# Altium schematic sheet 7V4输出2.SchDoc
size A4
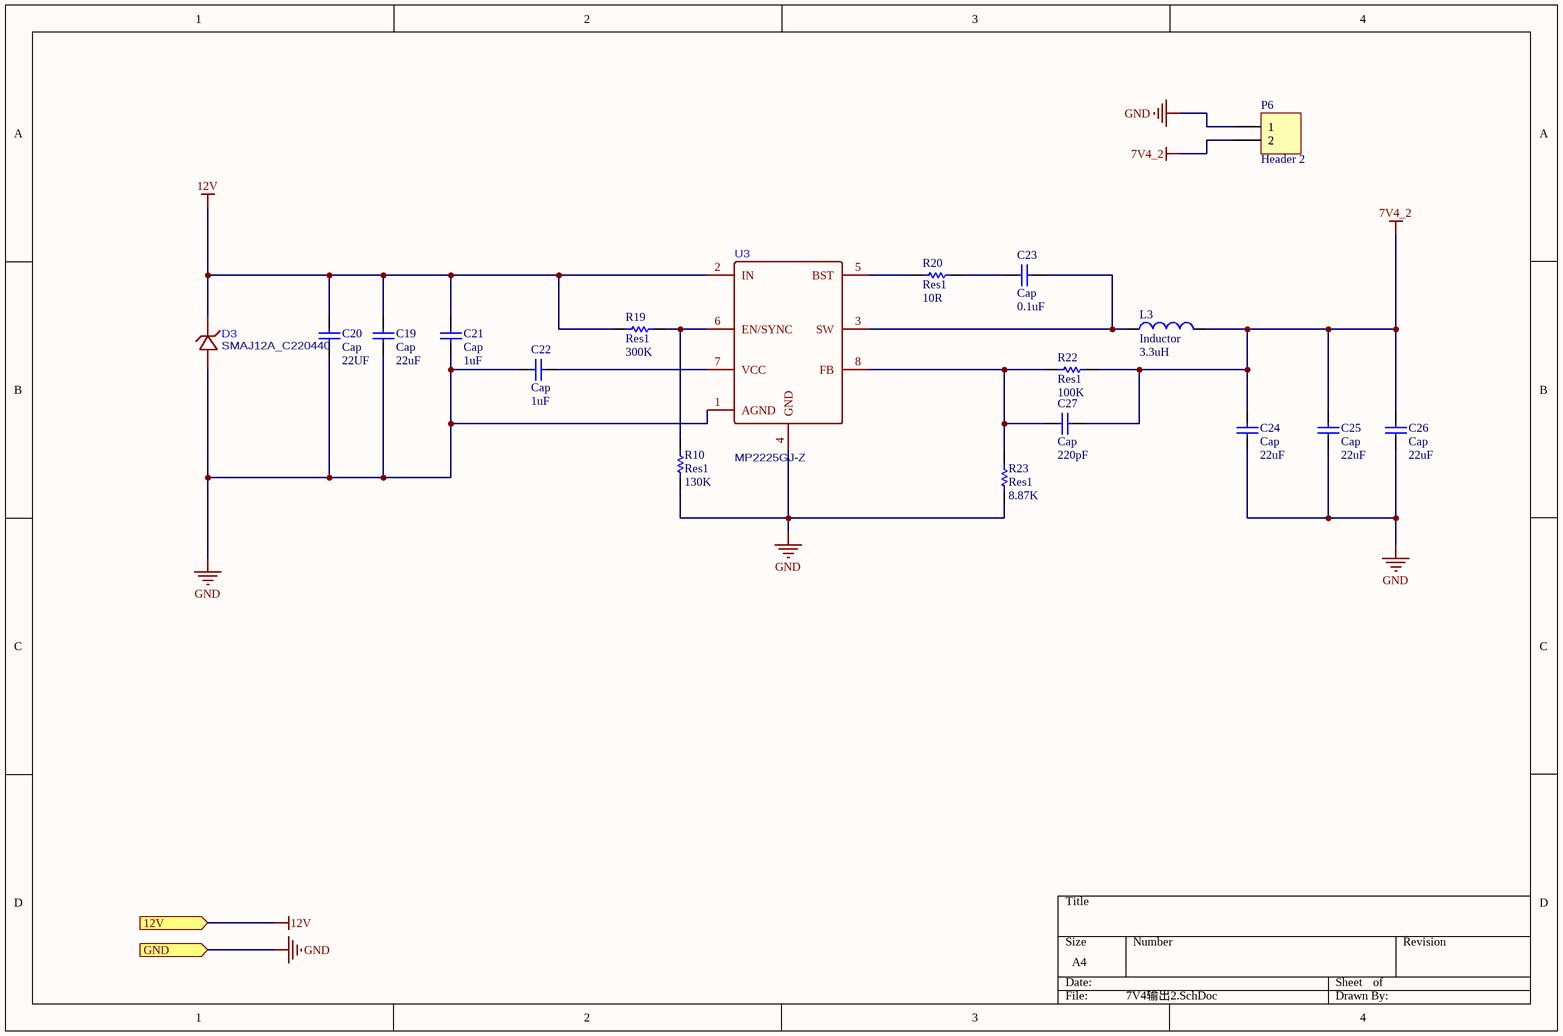
[diagram p0: 7V4输出2.SchDoc]

## Parts
C19  Cap  value 22uF  [C1206]
C20  Cap  value 22UF  [C1206]
C21  Cap  value 1uF  [R0603]
C22  Cap  value 1uF  [R0603]
C23  Cap  value 0.1uF  [R0603]
C24  Cap  value 22uF  [C0805]
C25  Cap  value 22uF  [C0805]
C26  Cap  value 22uF  [C0805]
C27  Cap  value 220pF  [R0603]
D3  SMAJ12A_C220440  [SMA_L4.4-W2.8-LS5.4-RD]
L3  Inductor  value 3.3uH  [IND-SMD_L7.8-W7.0_MAPM0630F]
P6  Header 2  [XH2.54-2A]
R10  Res1  value 130K  [R0603]
R19  Res1  value 300K  [R0603]
R20  Res1  value 10R  [R0603]
R22  Res1  value 100K  [R0603]
R23  Res1  value 8.87K  [R0603]
U3  MP2225GJ-Z  [TSOT-23-8_L2.9-W1.6-P0.65-LS2.8-BR]

## Ports
12V (in), GND (in)

## Nets
7V4_2: C24.2 C25.2 C26.2 C27.2 L3.2 P6.2 R22.2
12V: C19.2 C20.2 C21.2 D3.1 R19.1 U3.2(IN) ; port 12V
GND: C19.1 C20.1 C21.1 C22.1 C24.1 C25.1 C26.1 D3.2 P6.1 R10.1 R23.1 U3.1(AGND) U3.4(GND) ; port GND
NetC22_2: C22.2 U3.7(VCC)
NetC23_1: C23.1 R20.2
NetC23_2: C23.2 L3.1 U3.3(SW)
NetC27_1: C27.1 R22.1 R23.2 U3.8(FB)
NetR10_2: R10.2 R19.2 U3.6(EN/SYNC)
NetR20_1: R20.1 U3.5(BST)

## Library data of the parts
C19-C27 = Cap: Capacitor; Published: 8-Jun-2000; LatestRevisionDate: 17-Jul-2002; LatestRevisionNote: Re-released for DXP Platform.; PackageReference: RAD-0.3; Publisher: Altium Limited; PackageDescription: Radial Cap, Thru-Hole; 2 Leads; 0.3 in Pin Spacing
L3 = Inductor: Code_IEC: 1005; Published: 8-Jun-2000; LatestRevisionDate: 29-May-2009; LatestRevisionNote: IPC-7351 Footprint Added.; PackageReference: 0402-A; Publisher: Altium Limited; PackageDescription: Chip Inductor; Code_JEITA: 0402
P6 = Header 2: Header, 2-Pin; LatestRevisionDate: 17-Jul-2002; LatestRevisionNote: Re-released for DXP Platform.; Publisher: Altium Limited
R10 R19 R20 R22 R23 = Res1: Resistor; Published: 8-Jun-2000; LatestRevisionDate: 17-Jul-2002; LatestRevisionNote: Re-released for DXP Platform.; PackageReference: AXIAL-0.3; Publisher: Altium Limited; PackageDescription: Axial Device, Thru-Hole; 2 Leads; 0.3 in Pin Spacing